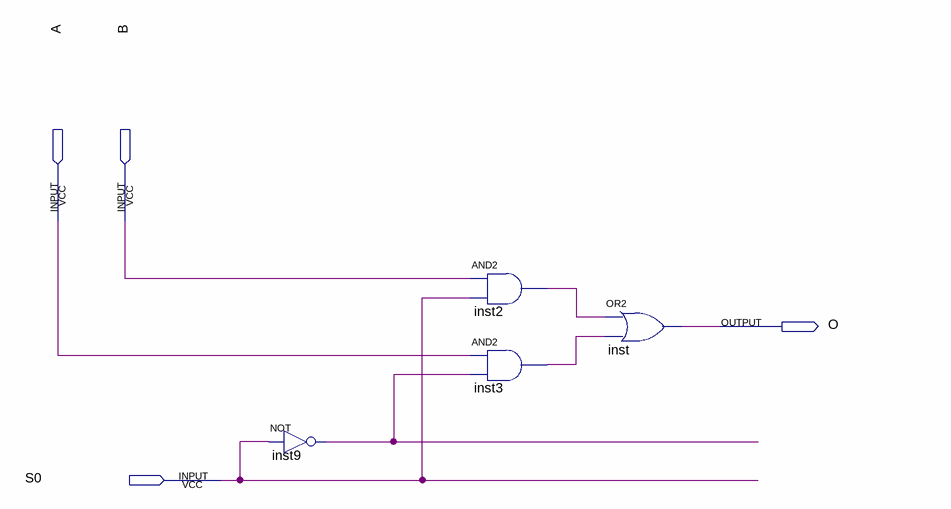
[diagram p0: schematic sheet]
// Quartus schematic Mux2x1.bdf as structural Verilog: 4 symbols, 4 pins
module Mux2x1 (
  input  A,
  input  B,
  input  S0,
  output O
);

  wire inst2_out, inst3_out, inst9_out;

  not inst9 (inst9_out, S0);
  and inst2 (inst2_out, B, S0);
  and inst3 (inst3_out, A, inst9_out);
  or inst (O, inst2_out, inst3_out);
endmodule
